# EAGLE design motadora (EAGLE 6.5.0)
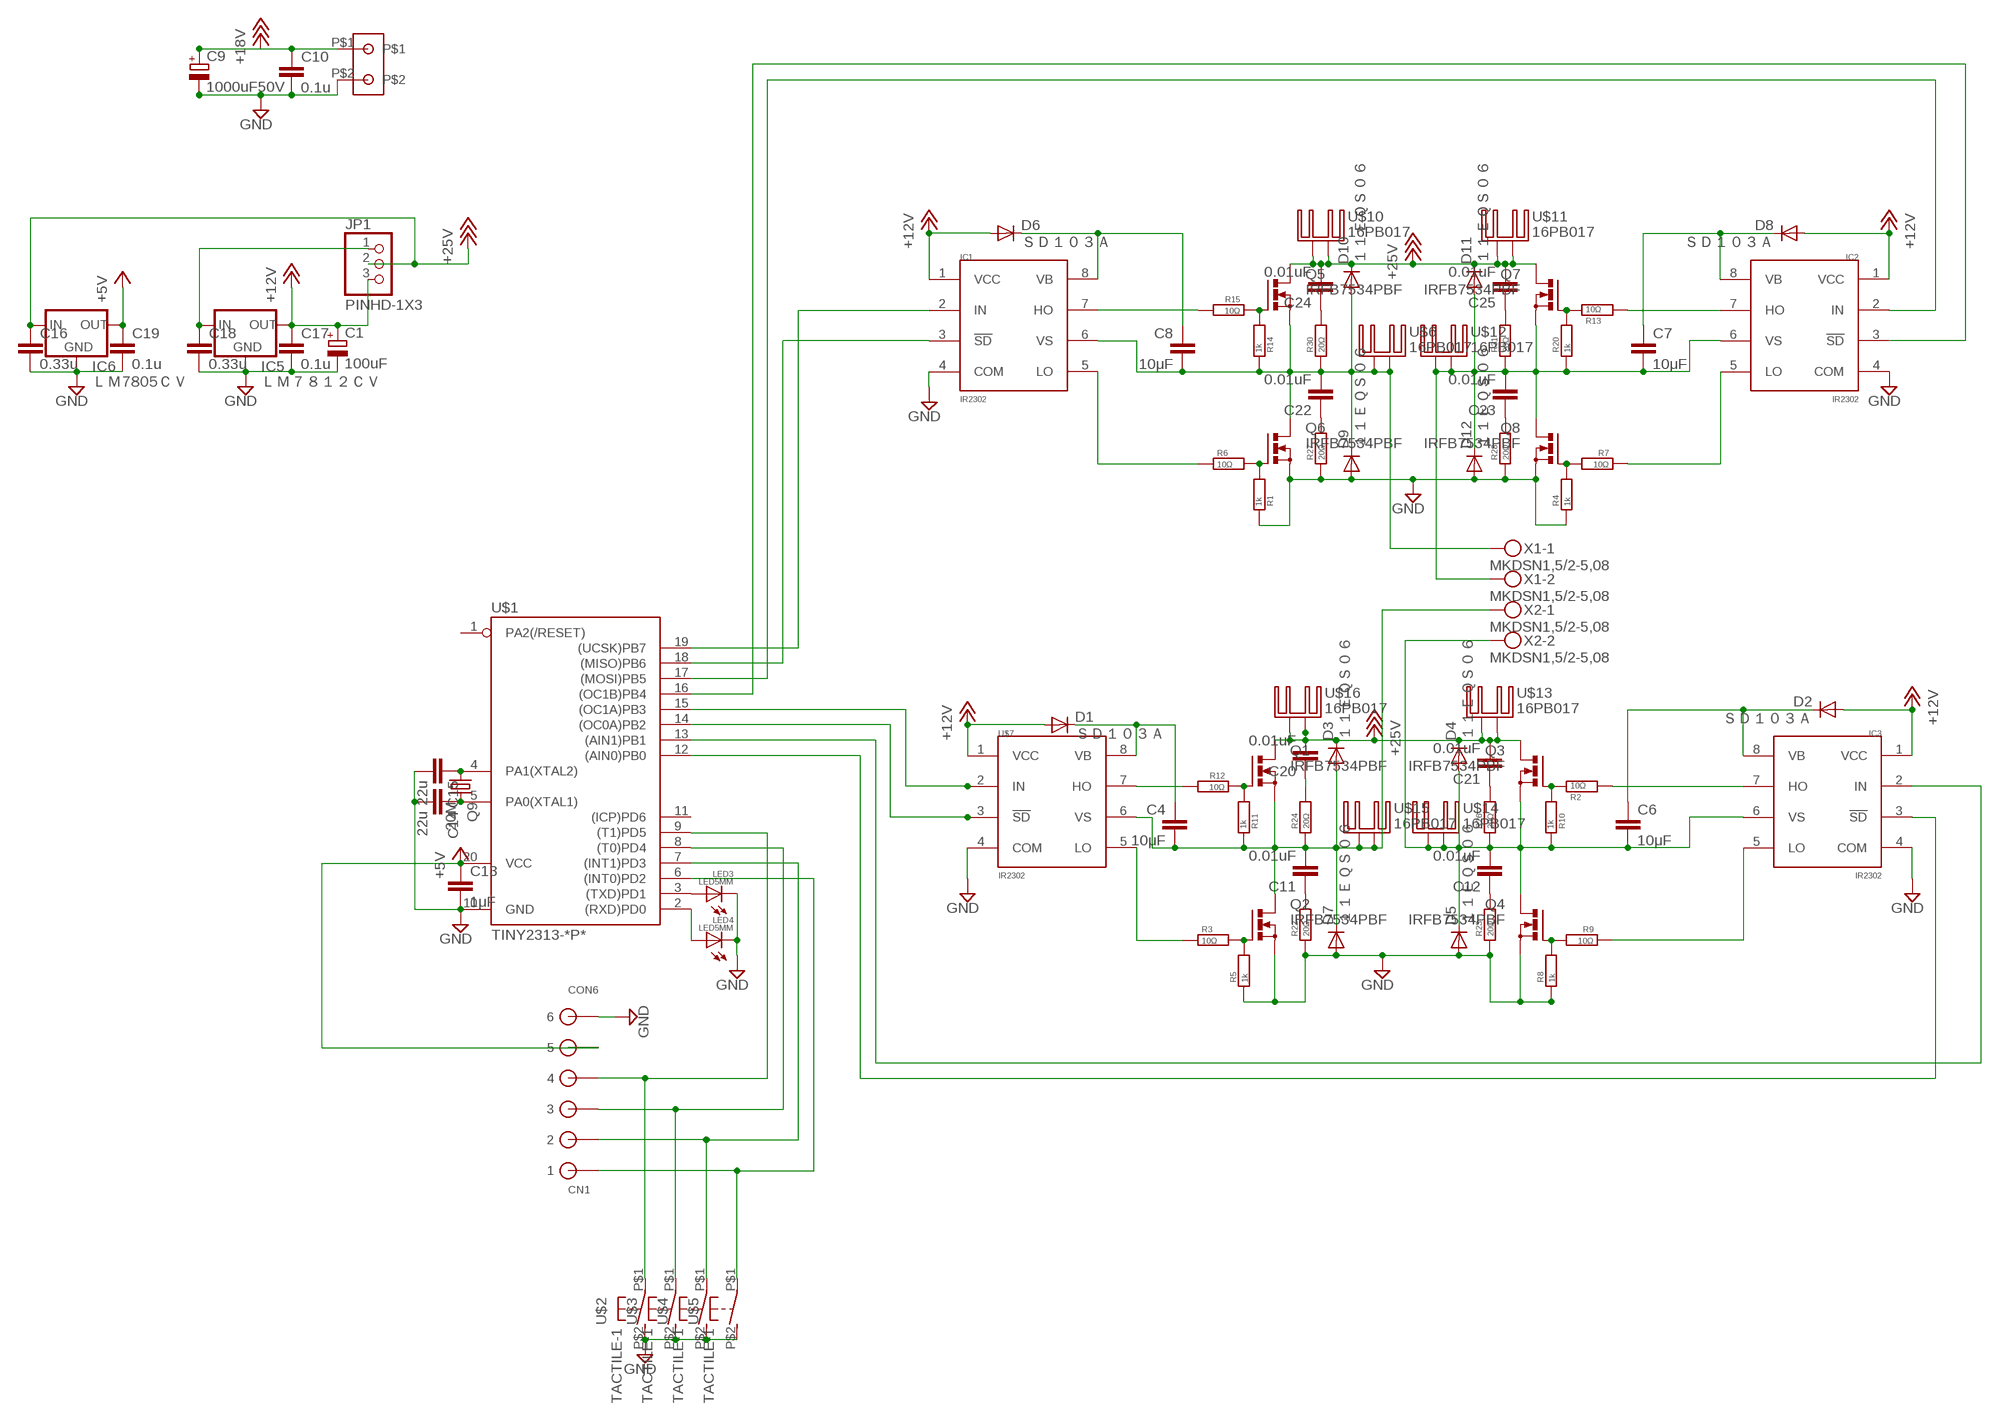
[diagram p0: schematic, sheet 1]

## Parts
C1  100uF  CPOL-EUTT2D6  [TT2D6]
C4  10μF  C-EU025-025X050  [C025-025X050]
C6  10μF  C-EU025-025X050  [C025-025X050]
C7  10μF  C-EU025-025X050  [C025-025X050]
C8  10μF  C-EU025-025X050  [C025-025X050]
C9  1000uF50V  CPOL-EUE5-13  [E5-13]
C10  0.1u  C5/3  [C5B3]
C11  0.01uF  C-EU025-024X044  [C025-024X044]
C12  0.01uF  C-EU025-024X044  [C025-024X044]
C13  1μF  C-EU050-025X075  [C050-025X075]
C14  22u  C-EU025-024X044  [C025-024X044]
C15  22u  C-EU025-024X044  [C025-024X044]
C16  0.33u  C-EU025-025X050  [C025-025X050]
C17  0.1u  C-EU025-025X050  [C025-025X050]
C18  0.33u  C-EU025-025X050  [C025-025X050]
C19  0.1u  C-EU025-025X050  [C025-025X050]
C20  0.01uF  C-EU025-024X044  [C025-024X044]
C21  0.01uF  C-EU025-024X044  [C025-024X044]
C22  0.01uF  C-EU025-024X044  [C025-024X044]
C23  0.01uF  C-EU025-024X044  [C025-024X044]
C24  0.01uF  C-EU025-024X044  [C025-024X044]
C25  0.01uF  C-EU025-024X044  [C025-024X044]
CN1  CON6  [CON6]
D1  ＳＤ１０３Ａ  DIODE-D-5  [D-5]
D2  ＳＤ１０３Ａ  DIODE-D-5  [D-5]
D3  １１ＥＱＳ０６  DIODE-D-5  [D-5]
D4  １１ＥＱＳ０６  DIODE-D-5  [D-5]
D5  １１ＥＱＳ０６  DIODE-D-5  [D-5]
D6  ＳＤ１０３Ａ  DIODE-D-5  [D-5]
D7  １１ＥＱＳ０６  DIODE-D-5  [D-5]
D8  ＳＤ１０３Ａ  DIODE-D-5  [D-5]
D9  １１ＥＱＳ０６  DIODE-D-5  [D-5]
D10  １１ＥＱＳ０６  DIODE-D-5  [D-5]
D11  １１ＥＱＳ０６  DIODE-D-5  [D-5]
D12  １１ＥＱＳ０６  DIODE-D-5  [D-5]
IC1  IR2302  IR2302IR2302  [DIL08]
IC2  IR2302  IR2302IR2302  [DIL08]
IC3  IR2302  IR2302IR2302  [DIL08]
IC5  ＬＭ７８１２ＣＶ  78XXS  [78XXS]
IC6  ＬＭ7805ＣＶ  78XXS  [78XXS]
JP1  PINHD-1X3  [1X03]
LED3  LED5MM  [LED5MM]
LED4  LED5MM  [LED5MM]
Q1  IRFB7534PBF  BUZ11BV  [TO220BV]
Q2  IRFB7534PBF  BUZ11BV  [TO220BV]
Q3  IRFB7534PBF  BUZ11BV  [TO220BV]
Q4  IRFB7534PBF  BUZ11BV  [TO220BV]
Q5  IRFB7534PBF  BUZ11BV  [TO220BV]
Q6  IRFB7534PBF  BUZ11BV  [TO220BV]
Q7  IRFB7534PBF  BUZ11BV  [TO220BV]
Q8  IRFB7534PBF  BUZ11BV  [TO220BV]
Q9  20M  CRYSTALHC49S  [HC49/S]
R1  1k  R-EU_0207/7  [0207/7]
R2  10Ω  R-EU_1/4W(2.5MM)  [1/4W(2.5MM)_]
R3  10Ω  R-EU_0207/10  [0207/10]
R4  1k  R-EU_0207/7  [0207/7]
R5  1k  R-EU_0207/7  [0207/7]
R6  10Ω  R-EU_0207/10  [0207/10]
R7  10Ω  R-EU_0207/10  [0207/10]
R8  1k  R-EU_0207/7  [0207/7]
R9  10Ω  R-EU_0207/10  [0207/10]
R10  1k  R-EU_1/4W(2.5MM)  [1/4W(2.5MM)_]
R11  1k  R-EU_1/4W(2.5MM)  [1/4W(2.5MM)_]
R12  10Ω  R-EU_1/4W(2.5MM)  [1/4W(2.5MM)_]
R13  10Ω  R-EU_1/4W(2.5MM)  [1/4W(2.5MM)_]
R14  1k  R-EU_1/4W(2.5MM)  [1/4W(2.5MM)_]
R15  10Ω  R-EU_1/4W(2.5MM)  [1/4W(2.5MM)_]
R20  1k  R-EU_1/4W(2.5MM)  [1/4W(2.5MM)_]
R22  20Ω  R-EU_0207/2V  [0207/2V]
R23  20Ω  R-EU_0207/2V  [0207/2V]
R24  20Ω  R-EU_0207/2V  [0207/2V]
R26  20Ω  R-EU_0207/2V  [0207/2V]
R27  20Ω  R-EU_0207/2V  [0207/2V]
R28  20Ω  R-EU_0207/2V  [0207/2V]
R30  20Ω  R-EU_1/4W(2.5MM)  [1/4W(2.5MM)_]
R31  20Ω  R-EU_0207/2V  [0207/2V]
T2  TANSIDAI  [A]
U$1  TINY2313-*P*  [DIL20]
U$2  TACTILE-1  [TACTILE]
U$3  TACTILE-1  [TACTILE]
U$4  TACTILE-1  [TACTILE]
U$5  TACTILE-1  [TACTILE]
U$6  16PB017  [16PB017]
U$7  IR2302  IR2302IR2302  [DIL08]
U$10  16PB017  [16PB017]
U$11  16PB017  [16PB017]
U$12  16PB017  [16PB017]
U$13  16PB017  [16PB017]
U$14  16PB017  [16PB017]
U$15  16PB017  [16PB017]
U$16  16PB017  [16PB017]
X1  MKDSN1,5/2-5,08  [MKDSN1,5/2-5,08]
X2  MKDSN1,5/2-5,08  [MKDSN1,5/2-5,08]

## Nets
+5V: C13.1 C19.1 CN1.P$5 IC6.OUT U$1.20(VCC)
+12V: C1.+ C17.1 D1.A D2.A D6.A D8.A IC1.1(VCC) IC2.1(VCC) IC3.1(VCC) IC5.OUT JP1.3 U$7.1(VCC)
+18V: C9.+ C10.1 C16.1 C20.2 C21.2 C24.2 C25.2 D3.C D4.C D10.C D11.C IC6.IN JP1.2 Q1.D Q3.D Q5.D Q7.D T2.P$1 U$10.P$1(K) U$10.P$2(K) U$11.P$1(K) U$11.P$2(K) U$13.P$1(K) U$13.P$2(K) U$16.P$1(K) U$16.P$2(K) ; supply symbol labelled +25V
GND: C1.- C9.- C10.2 C13.2 C14.2 C15.2 C16.2 C17.2 C18.2 C19.2 CN1.P$6 D5.A D7.A D9.A D12.A IC1.4(COM) IC2.4(COM) IC3.4(COM) IC5.GND IC6.GND LED3.K(C) LED4.K(C) Q2.S Q4.S Q6.S Q8.S R1.1 R4.1 R5.1 R8.1 R22.1 R23.1 R27.1 R28.1 T2.P$2 U$1.10(GND) U$2.P$2(S) U$3.P$2(S) U$4.P$2(S) U$5.P$2(S) U$7.4(COM)
N$1: IC1.7(HO) R15.4
N$2: IC2.7(HO) R13.4
N$3: IC3.7(HO) R2.4
N$4: Q2.G R3.2 R5.2
N$5: R12.4 U$7.7(HO)
N$6: IC1.5(LO) R6.1
N$7: Q1.G R11.4 R12.3
N$8: C4.2 C11.2 D3.A D7.C Q1.S Q2.D R11.3 R24.1 U$7.6(VS) U$15.P$1(K) U$15.P$2(K) X2.1
N$9: C4.1 D1.C U$7.8(VB)
N$10: C6.1 D2.C IC3.8(VB)
N$11: R3.1 U$7.5(LO)
N$12: C7.1 D8.C IC2.8(VB)
N$13: Q5.G R14.4 R15.3
N$15: C6.2 C12.2 D4.A D5.C IC3.6(VS) Q3.S Q4.D R10.3 R26.1 U$14.P$1(K) U$14.P$2(K) X2.2
N$16: C8.1 D6.C IC1.8(VB)
N$17: Q4.G R8.2 R9.2
N$18: CN1.P$2 U$1.7((INT1)PD3) U$4.P$1(P)
N$19: C7.2 C23.2 D11.A D12.C IC2.6(VS) Q7.S Q8.D R20.3 R31.1 U$12.P$1(K) U$12.P$2(K) X1.2
N$20: CN1.P$1 U$1.6((INT0)PD2) U$5.P$1(P)
N$21: Q6.G R1.2 R6.2
N$22: C14.1 Q9.2 U$1.5(PA0(XTAL1))
N$23: LED3.A U$1.3((TXD)PD1)
N$24: IC1.3(!SD) U$1.18((MISO)PB6)
N$25: C15.1 Q9.1 U$1.4(PA1(XTAL2))
N$26: Q8.G R4.2 R7.2
N$27: C8.2 C22.2 D9.C D10.A IC1.6(VS) Q5.S Q6.D R14.3 R30.3 U$6.P$1(K) U$6.P$2(K) X1.1
N$32: LED4.A U$1.2((RXD)PD0)
N$37: C18.1 IC5.IN JP1.1
N$38: C11.1 R22.2
N$39: C12.1 R23.2
N$40: IC2.5(LO) R7.1
N$42: C20.1 R24.2
N$43: C21.1 R26.2
N$44: C22.1 R27.2
N$45: C23.1 R28.2
N$46: C24.1 R30.4
N$47: C25.1 R31.2
N$48: Q3.G R2.3 R10.4
N$51: Q7.G R13.3 R20.4
N$54: IC3.5(LO) R9.1
N$55: IC1.2(IN) U$1.19((UCSK)PB7)
N$57: IC2.2(IN) U$1.17((MOSI)PB5)
N$58: IC2.3(!SD) U$1.16((OC1B)PB4)
N$59: U$1.15((OC1A)PB3) U$7.2(IN)
N$60: U$1.14((OC0A)PB2) U$7.3(!SD)
N$61: IC3.2(IN) U$1.13((AIN1)PB1)
N$62: IC3.3(!SD) U$1.12((AIN0)PB0)
N$63: CN1.P$4 U$1.9((T1)PD5) U$2.P$1(P)
N$64: CN1.P$3 U$1.8((T0)PD4) U$3.P$1(P)
Unconnected: U$1.1(PA2(/RESET)) U$1.11((ICP)PD6)

## Library data of the parts
C1 C9 = _rcl:CPOL-EU: POLARIZED CAPACITOR, European symbol
C4 C6-C8 C14 C15 = _rcl:C-EU: CAPACITOR, European symbol
C10 = capacitor-wima:C: CAPACITOR naming: grid - package width
C11-C13 C16-C25 = _resistor(抵抗):C-EU: CAPACITOR, European symbol
CN1 = _XH-con(XHｺﾈｸﾀ):CON6: low insertion connector 6
D1-D12 = _diode(ﾀﾞｲｵｰﾄﾞ):DIODE-: DIODE
IC1-IC3 U$7 = _irs(ｹﾞｰﾄﾄﾞﾗｲﾊﾞIC):IR2302
IC5 IC6 = 00v-reg(ﾄﾗﾝｼﾞｽﾀ&FET):78XXS: VOLTAGE REGULATOR
JP1 = _pinhead(ﾋﾟﾝﾍｯﾀﾞ):PINHD-1X3: PIN HEADER
LED3 LED4 = _led:LED
Q1-Q8 = transistor-power:BUZ11: N-CHANNEL MOS FET
Q9 = crystal:CRYSTAL: CRYSTAL; OC_FARNELL: 1667008; OC_NEWARK: unknown
R1-R15 R20 R22-R24 R26-R28 R30 R31 = _resistor(抵抗):R-EU_: RESISTOR, European symbol
T2 = 000tansidai:TANSIDAI: TANSIDAI 1Kyoku
U$1 = avr-6:TINY2313*: Atmel Tiny2313 2K Flash, 128 bytes EEPROM, 128 bytes RAM
U$2-U$5 = _switch:TACTILE-1
U$6 U$10-U$16 = _Heatsink(ﾋｰﾄｼﾝｸ秋月):16PB017
X1 X2 = 0con-phoenix-508(ﾀｰﾐﾅﾙ):MKDSN1,5/2-5,08: MKDSN 1,5/ 2-5,08 Printklemme Nennstrom: 13,5 A Nennspannung: 250 V Rastermaß: 5,08 mm Polzahl: 2 Anschlussart: Schraubanschluss Montage: Löten Anschlussrichtung Leiter/Platine: 0 ° Artikelnummer: 1729128 Source: http://eshop.phoenixcontact.com .. 1729128.pdf; MPN: MKDSN 1,5/2-5.08; OC_FARNELL: 1792903; OC_NEWARK: 30M2397

## Board
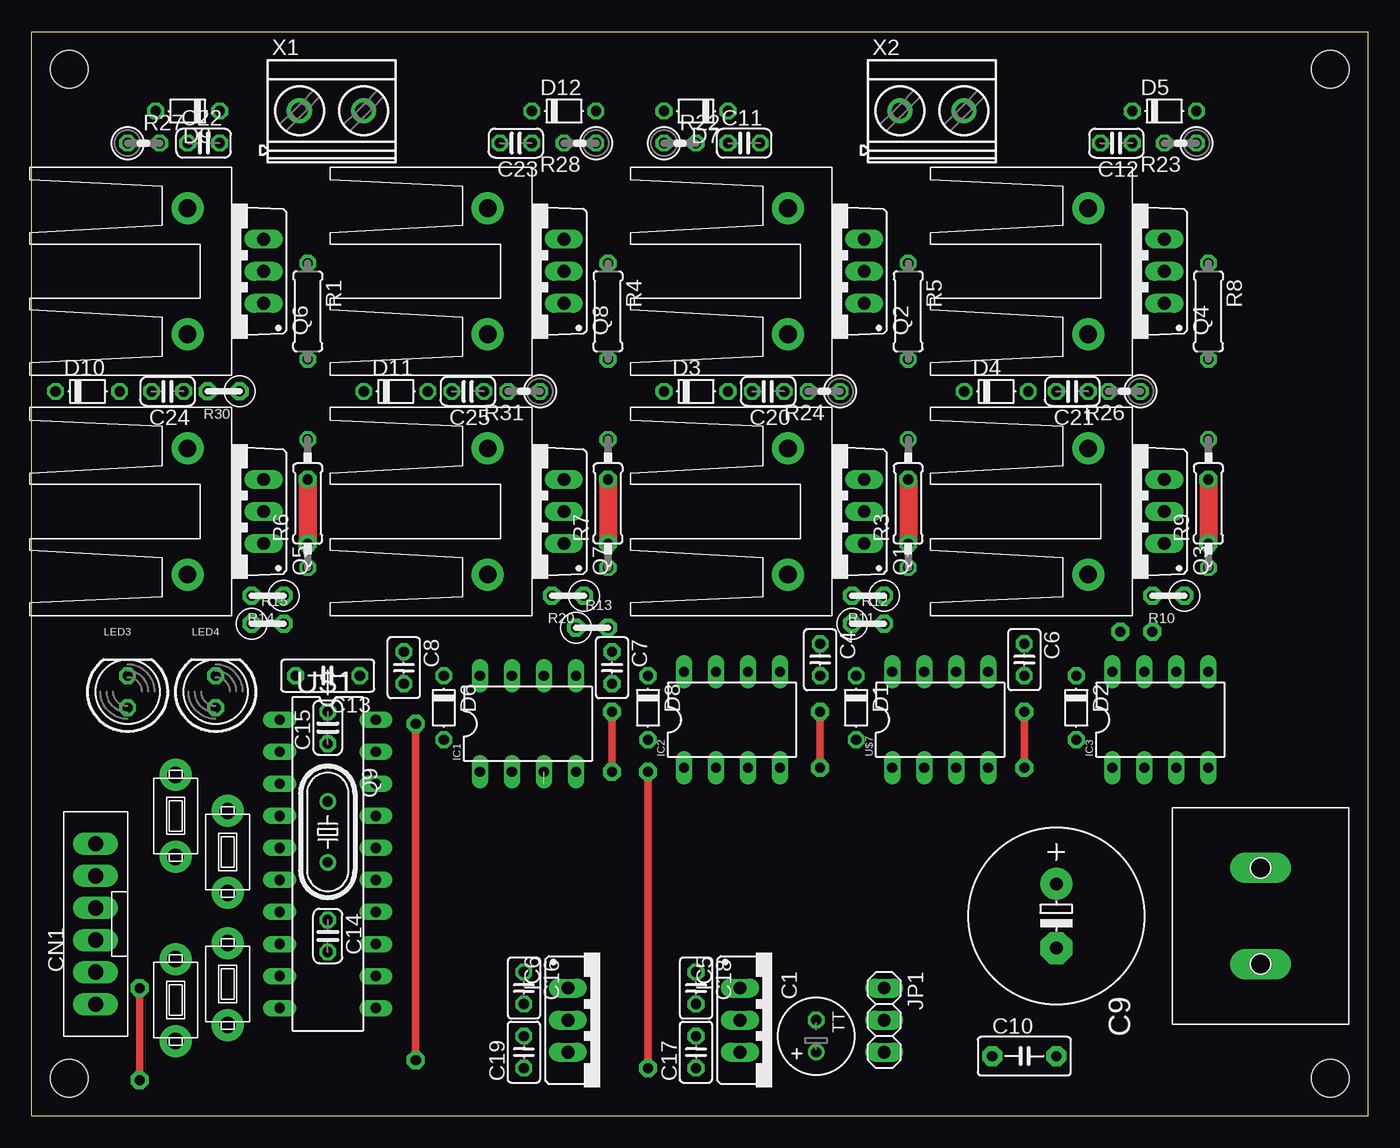
[diagram p1: board, top side]
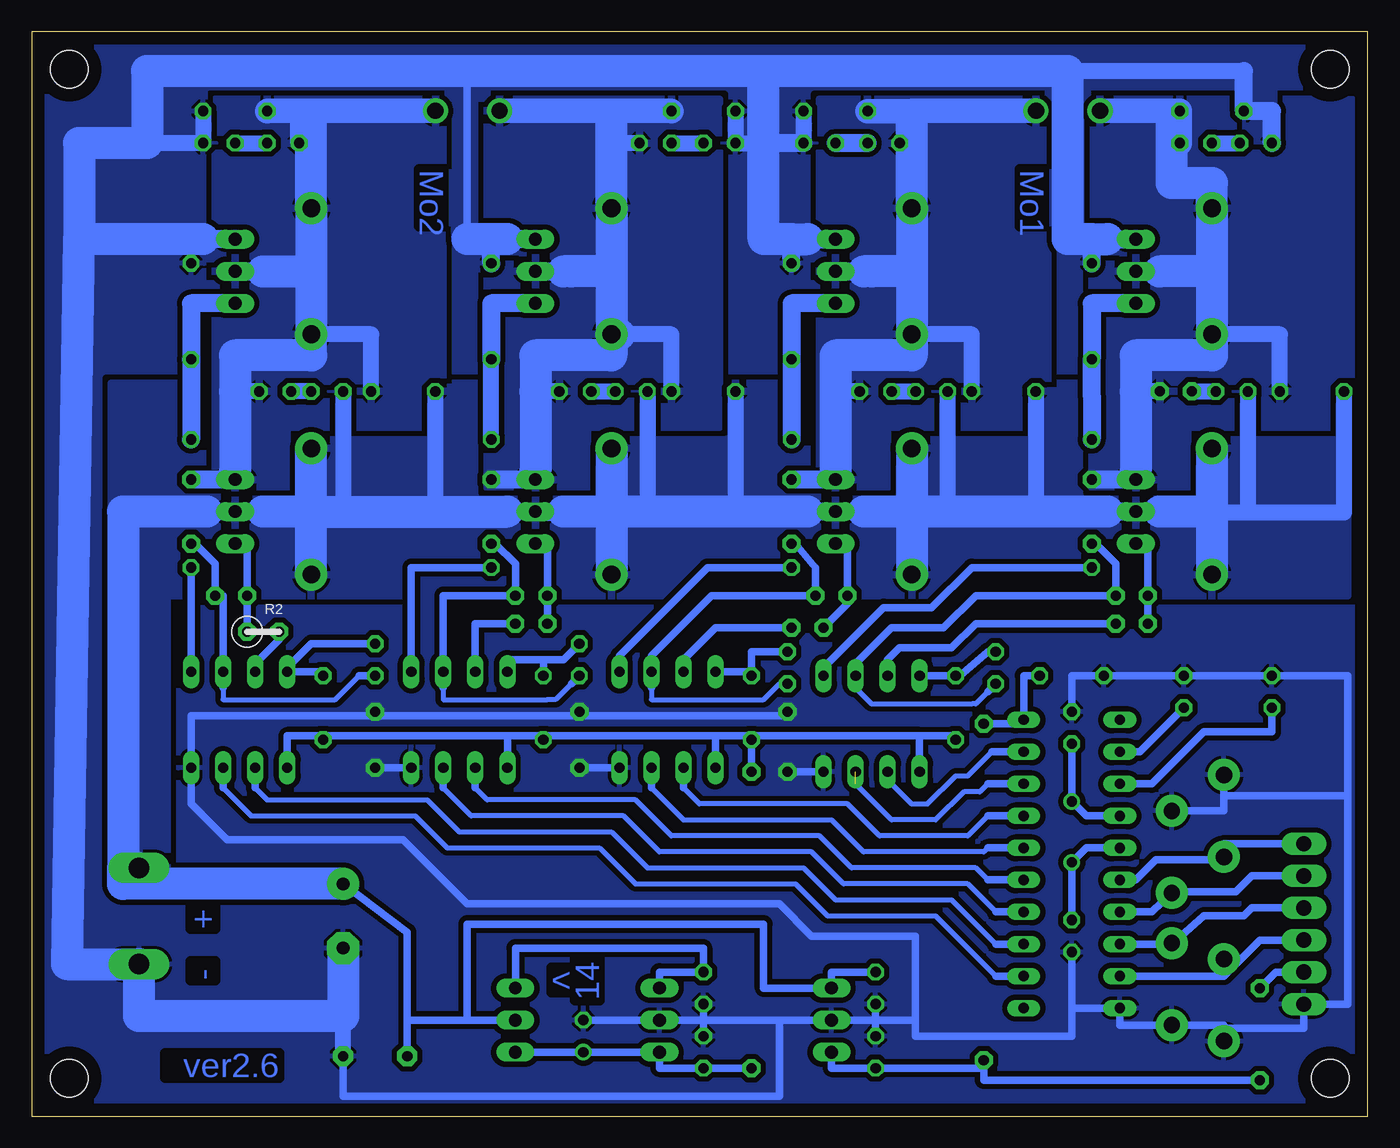
[diagram p2: board, bottom side, seen from below]

Size 106 x 86 mm. Coordinates in mm from the lower left corner, seen from the top.
Outline: 0,0 0,86 106,86 106,0 0,0
Copper layers (1*16): Top 0.035mm / dielectric 1.5mm / Bottom 0.035mm
Design rules "default *": minimum track width 10mil, minimum drill 24mil, track to track 8mil, track to pad 8mil, pad to pad 8mil, via to via 8mil, smd to smd 8mil, copper to edge 40mil, drill to drill 8mil, minimum pad ring 10mil, minimum via ring 8mil, stop-mask expansion 4mil, vias tented up to drill 0mil, thermal gap 10mil
Holes 3 mm at 3,3 103,3 103,83 3,83

### Footprints (pad centres in the part's own frame; a part is rotated, then mirrored left to right if it is on the bottom)
TT2D6 = drill 0.813: + -1.27,0 | drill 0.813 octagon: - 1.27,0
C025-025X050 = drill 0.813 octagon: 1 -1.27,0; 2 1.27,0
E5-13 = drill 1.016 pad 2.54: + -2.54,0 | drill 1.016 pad 2.54 octagon: - 2.54,0
C5B3 = drill 0.813 pad 1.6 octagon: 1 -2.54,0; 2 2.54,0
C025-024X044 = drill 0.813 octagon: 1 -1.27,0; 2 1.27,0
C050-025X075 = drill 0.813 octagon: 1 -2.54,0; 2 2.54,0
CON6 = drill 1.2 long: P$1 6.35,0; P$2 3.81,0; P$3 1.27,0; P$4 -1.27,0; P$5 -3.81,0; P$6 -6.35,0
D-5 = drill 0.813 octagon: A 2.54,0; C -2.54,0
DIL08 = drill 0.813 long: 1 -3.81,-3.81; 2 -1.27,-3.81; 3 1.27,-3.81; 4 3.81,-3.81; 5 3.81,3.81; 6 1.27,3.81; 7 -1.27,3.81; 8 -3.81,3.81
78XXS = drill 1.016 long: GND 0,-2.54; IN -2.54,-2.54; OUT 2.54,-2.54
1X03 = drill 1.016 long: 1 -2.54,0; 2 0,0; 3 2.54,0
LED5MM = drill 0.813 octagon: A -1.27,0; K 1.27,0
TO220BV = drill 1.016 long: D 0,-2.54; G -2.54,-2.54; S 2.54,-2.54
HC49/S = drill 0.813: 1 -2.413,0; 2 2.413,0
0207/7 = drill 0.813 octagon: 1 -3.81,0; 2 3.81,0
1/4W(2.5MM)_ = drill 0.8 pad 1.422 octagon: 3 1.27,0; 4 -1.27,0
0207/10 = drill 0.813 octagon: 1 -5.08,0; 2 5.08,0
0207/2V = drill 0.813 octagon: 1 -1.27,0; 2 1.27,0
A = drill 1.6 long: P$1 3.81,0; P$2 -3.81,0
DIL20 = drill 0.813 long: 1 -11.43,-3.81; 2 -8.89,-3.81; 3 -6.35,-3.81; 4 -3.81,-3.81; 5 -1.27,-3.81; 6 1.27,-3.81; 7 3.81,-3.81; 8 6.35,-3.81; 9 8.89,-3.81; 10 11.43,-3.81; 11 11.43,3.81; 12 8.89,3.81; 13 6.35,3.81; 14 3.81,3.81; 15 1.27,3.81; 16 -1.27,3.81; 17 -3.81,3.81; 18 -6.35,3.81; 19 -8.89,3.81; 20 -11.43,3.81
TACTILE = drill 1.3 pad 2.54: P$1 3.25,0; P$2 -3.25,0
16PB017 = drill 1.4 pad 2.54: P$1 -5,3.5; P$2 5,3.5
MKDSN1,5/2-5,08 = drill 1.3 pad 2: 1 -2.561,0.025; 2 2.519,0.025

### Placement (x,y rotation side)
C1  62.23,6.35 90 top
C4  62.55,36.2 270 top
C6  78.74,36.2 270 top
C7  46.04,35.56 270 top
C8  29.53,35.56 270 top
C9  81.28,15.88 270 top
C10  78.74,4.76 0 top
C11  56.52,77.15 0 top
C12  86.04,77.15 180 top
C13  23.5,34.92 180 top
C14  23.5,14.29 270 top
C15  23.5,30.8 90 top
C16  39.05,10.16 270 top
C17  52.7,5.08 90 top
C18  52.7,10.16 270 top
C19  39.05,5.08 90 top
C20  58.42,57.47 180 top
C21  82.55,57.47 180 top
C22  13.65,77.15 0 top
C23  38.42,77.15 180 top
C24  10.79,57.47 180 top
C25  34.61,57.47 180 top
CN1  5.08,15.24 90 top
D1  65.41,32.38 270 top
D2  82.87,32.38 270 top
D3  52.7,57.47 0 top
D4  76.52,57.47 0 top
D5  89.85,79.69 0 top
D6  32.7,32.38 270 top
D7  52.7,79.69 180 top
D8  48.9,32.38 270 top
D9  12.38,79.69 180 top
D10  4.45,57.47 0 top
D11  28.89,57.47 0 top
D12  42.23,79.69 0 top
IC1  39.37,31.11 0 top
IC2  55.56,31.43 0 top
IC3  89.53,31.43 0 top
IC5  58.74,7.62 270 top
IC6  45.09,7.62 270 top
JP1  67.63,7.62 270 top
LED3  7.62,33.66 90 top
LED4  14.61,33.66 90 top
Q1  63.5,47.94 90 top
Q2  63.5,66.99 90 top
Q3  87.31,47.94 90 top
Q4  87.31,66.99 90 top
Q5  15.88,47.94 90 top
Q6  15.88,66.99 90 top
Q7  39.69,47.94 90 top
Q8  39.69,66.99 90 top
Q9  23.5,22.54 270 top
R1  21.91,63.82 270 top
R2  87.63,38.42 180 bottom
R3  69.53,48.58 90 top
R4  45.72,63.82 270 top
R5  69.53,63.82 270 top
R6  21.91,48.58 90 top
R7  45.72,48.58 90 top
R8  93.34,63.82 270 top
R9  93.34,48.58 90 top
R10  90.17,41.27 0 top
R11  66.36,41.27 0 top
R12  66.36,39.05 180 top
R13  44.45,38.73 180 top
R14  18.73,41.27 0 top
R15  18.73,39.05 180 top
R20  42.55,41.27 0 top
R22  51.44,77.15 0 top
R23  91.12,77.15 180 top
R24  62.87,57.47 180 top
R26  86.68,57.47 180 top
R27  8.89,77.15 0 top
R28  43.5,77.15 180 top
R30  15.24,57.47 0 top
R31  39.05,57.47 180 top
T2  97.47,15.88 90 top
U$1  23.5,20 270 top
U$2  11.43,9.21 90 top
U$3  15.56,10.48 90 top
U$4  15.56,20.95 270 top
U$5  11.43,23.81 270 top
U$6  15.88,66.99 90 top
U$7  72.07,31.43 0 top
U$10  15.88,47.94 90 top
U$11  39.69,47.94 90 top
U$12  39.69,66.99 90 top
U$13  63.5,47.94 90 top
U$14  87.31,66.99 90 top
U$15  63.5,66.99 90 top
U$16  87.31,47.94 90 top
X1  23.81,79.69 0 top
X2  71.44,79.69 0 top

### Tracks (layer width: path | path; a pad name or v marks a point on that pad's centre or on a via)
+5V  (via drill 0.8 pad 1.42)
  Top 0.61: v30.48,31.11 v30.48,4.45 | v8.57,10.16 v8.57,2.86
  Bottom 0.61: IC6.OUT 42.55,3.81 C19.1 30.48,3.81 | C13.1 27.3,34.92 U$1.20 27.62,31.11 v30.48,31.11 | CN1.P$5 7.3,11.43 v8.57,10.16 | v8.57,2.86 30.48,2.86 30.48,3.81 | v30.48,4.45 30.48,3.81
+12V  (via drill 0.8 pad 1.42)
  Top 0.61: v48.9,3.81 v48.9,27.3
  Bottom 0.61: D1.A 65.41,30.16 | 65.41,30.16 68.26,30.16 | D2.A 82.87,30.16 | 82.87,30.16 85.72,30.16 IC3.1 | 48.9,30.16 51.75,30.16 | IC1.1 35.56,30.16 | 35.56,30.16 48.9,30.16 | 48.9,30.16 D8.A v48.9,27.3 | 51.75,30.16 65.41,30.16 | 68.26,30.16 82.87,30.16 | U$7.1 68.26,30.16 | IC2.1 51.75,30.16 | 35.56,30.16 32.7,30.16 D6.A | v48.9,3.81 C17.1 56.2,3.81 IC5.OUT C1.+ JP1.3
+18V
  Bottom 0.61: 63.82,47.94 60,47.94 | Q7.D 40.32,47.94 40.01,47.94 36.19,47.94 | C16.1 42.55,11.43 IC6.IN 47.94,10.16 47.94,15.24 71.44,15.24 71.44,7.62 | JP1.2 71.44,7.62 | 71.44,7.62 76.2,7.62 | 76.2,7.62 C10.1 | C9.+ 76.2,14.61 76.2,7.62
  Bottom 1.27: 40.32,47.94 50.16,47.94 D3.C | Q1.D 68.26,47.94 | 87.63,47.94 Q3.D 92.08,47.94 | D10.C 1.91,47.86 9.53,47.86 | 9.53,47.86 12.38,47.86 12.38,47.94 U$10.P$2 | D11.C 26.35,47.94 | D4.C 73.98,47.94 | C24.2 9.53,47.86 | C21.2 81.28,47.94 | C20.2 57.15,47.94 | C25.2 33.34,47.94
  Bottom 1.422: 15.88,47.94 16.51,47.94 Q5.D 20.64,47.94 | Q1.D 63.82,47.94 | Q7.D 43.18,47.94
  Bottom 2.54: U$16.P$1 83.81,47.94 | 83.81,47.94 U$16.P$2 | U$13.P$1 60,47.94 U$13.P$2 | U$11.P$1 36.19,47.94 U$11.P$2 | U$10.P$1 U$10.P$2 12.38,47.94 16.51,47.94 | 20.64,47.94 26.35,47.94 33.34,47.94 40.01,47.94 | 44.45,47.94 50.16,47.94 57.15,47.94 63.82,47.94 | 83.81,47.94 87.63,47.94 | 83.81,47.94 81.28,47.94 73.98,47.94 68.26,47.94 | 92.08,47.94 98.74,47.94 98.74,19.68 | C9.+ 98.74,18.41 98.74,19.68 | 98.74,19.68 T2.P$1
  pour Bottom (isolate 0.406, rank 2): 1.59,58.1 99.69,58.1 99.69,18.41 95.25,18.41 95.25,41.27 1.59,41.27
GND  (via drill 0.8 pad 1.42)
  Top 0.61: v46.04,27.3 v46.04,32.07 | v62.55,27.62 v62.55,32.07 | v78.74,27.62 v78.74,32.07
  Bottom 0.61: 52.7,7.62 C17.2 | 39.05,7.62 IC6.GND | C19.2 39.05,7.62 | 24.45,70.17 21.91,70.17 R1.1 | 48.26,69.53 47.94,69.53 | 71.44,82.87 71.44,69.53 | C15.2 23.5,34.92 C13.2 LED4.K | LED3.K LED4.K | U$5.P$2 11.43,25.4 | U$2.P$2 11.43,6.99 | 23.5,8.57 U$1.10 19.68,7.23 U$3.P$2 11.43,7.23 11.43,6.99 | 23.5,8.57 C14.2 | LED4.K 1.59,34.92 1.59,25.4 | 1.59,25.4 1.59,8.89 CN1.P$6 5.08,6.99 11.43,6.99 | U$4.P$2 11.43,24.2 11.43,25.4 | 11.43,25.4 1.59,25.4 | IC1.4 v46.04,27.3 | v46.04,32.07 46.04,31.75 62.55,31.75 | IC2.4 v62.55,27.62 | v62.55,32.07 62.55,31.75 | 62.55,31.75 78.74,31.75 | U$7.4 v78.74,27.62 | R8.1 93.34,69.22 93.03,69.53 | v78.74,32.07 78.74,31.75 | 78.74,31.75 93.34,31.75 IC3.4 93.34,24.77 90.49,21.91 76.52,21.91 71.44,16.83 46.67,16.83 44.13,14.29 35.88,14.29 35.88,7.62 | C16.2 39.05,7.62 | IC6.GND 46.67,7.62 | 46.67,7.62 52.7,7.62 | 52.7,7.62 IC5.GND C1.- | 23.5,8.57 23.5,6.35 35.88,6.35 35.88,7.62 | C18.2 52.7,7.62 | C10.2 81.28,1.59 46.67,1.59 46.67,7.62 | C9.- 81.28,8.26 97.47,8.26 | IC6.GND 35.88,7.62
  Bottom 1.27: 47.62,69.53 47.94,69.53 | 47.94,77.15 R22.1 D7.A | 9.84,82.87 23.81,82.87 | 96.84,77.15 R23.1 D5.A | D12.A R28.1 | C10.2 C9.-
  Bottom 1.422: Q2.S 68.26,69.53 69.53,69.53 R5.1 | Q4.S 92.39,69.53 | R4.1 45.72,69.53 | R1.1 21.91,69.53 | R27.1 7.62,79.69 D9.A 9.84,82.87 | R28.1 47.94,77.15 | 44.45,69.53 Q8.S | 20.64,69.53 Q6.S
  Bottom 2.54: 92.39,69.53 93.03,69.53 102.23,69.53 | 47.94,82.87 23.81,82.87 23.81,69.53 21.91,69.53 20.64,69.53 | 47.94,69.53 47.94,77.15 47.94,82.87 | 47.94,82.87 71.44,82.87 96.84,82.87 96.84,77.15 102.23,77.15 102.23,69.53 | 102.23,69.53 103.19,12.06 T2.P$2 97.47,8.26 97.47,7.94 81.28,7.94 C9.- | 47.62,69.53 45.72,69.53 44.45,69.53 | 68.26,69.53 71.44,69.53
  pour Bottom (isolate 0.406, rank 6): -5.4,89.22 -5.4,-4.45 109.22,-4.45 109.22,89.22
N$1
  Bottom 0.61: IC1.7 38.1,36.2 37.15,37.15 33.02,37.15 31.11,39.05 R15.4
N$2
  Bottom 0.61: IC2.7 54.29,36.2 51.75,38.73 R13.4
N$3
  Bottom 0.61: R2.4 86.36,37.78 88.27,35.88 IC3.7
N$4
  Bottom 1.27: R3.2 R5.2
  Bottom 1.422: Q2.G 69.53,64.45 R5.2
N$5
  Bottom 0.61: R12.4 70.8,39.05 U$7.7
N$6
  Bottom 0.61: IC1.5 43.18,35.56 38.42,40.32 34.61,40.32 31.43,43.5 R6.1
N$7
  Bottom 0.61: R11.4 R12.3 65.09,45.4 Q1.G
N$8  (via drill 0.8 pad 1.42)
  Top 1.422: v69.53,50.48 v69.53,45.4
  Bottom 0.406: 73.34,33.97 73.34,33.02 65.09,33.02 64.45,33.02 63.18,34.29
  Bottom 0.61: v69.53,45.4 69.22,45.4 67.63,43.81 R11.3 73.34,41.27 U$7.6 73.34,33.97 | C4.2 63.18,34.29
  Bottom 1.27: Q1.S 66.04,51.12 66.04,51.75 | D3.A 55.24,61.99 59.37,61.99 | R24.1 66.04,57.47 | C11.2 60,77.15
  Bottom 1.422: Q2.D 63.18,66.99 | Q1.S v69.53,50.48
  Bottom 1.93: X2.1 60,79.72 | 60,79.72 60,79.38 | D7.C 55.27,79.72 60,79.72
  Bottom 2.54: U$15.P$1 60,60.33 66.04,60.33 66.04,57.47 66.04,51.12 | U$15.P$2 U$15.P$1 | U$15.P$1 59.37,61.99 | U$15.P$2 60,66.99 63.18,66.99 63.82,66.99 | U$15.P$2 60,77.15 60,79.38 60.01,79.38
  pour Bottom (isolate 0.406): 69.85,80.64 69.85,49.85 61.91,49.85 61.91,54.61 51.44,54.61 51.44,80.64
N$9
  Bottom 0.61: C4.1 63.82,36.2 65.41,36.2 | 65.41,36.2 68.26,36.2 U$7.8 | D1.C 65.41,36.2
N$10
  Bottom 0.61: C6.1 83.82,37.47 85.72,35.56 IC3.8 82.87,35.24 D2.C
N$11
  Bottom 0.61: R3.1 75.88,43.5 U$7.5
N$12
  Bottom 0.61: IC2.8 48.9,35.24 D8.C 48.9,36.83 C7.1
N$13
  Bottom 0.61: Q5.G 17.46,45.4 R14.4 R15.3
N$15  (via drill 0.8 pad 1.42)
  Top 1.422: v93.34,50.48 v93.34,45.4
  Bottom 0.406: 90.81,33.97 90.81,33.02 81.92,33.02 80.01,34.92
  Bottom 0.61: U$14.P$1 | v93.34,45.4 93.03,45.4 91.44,43.81 R10.3 90.81,41.27 IC3.6 90.81,33.97 | 80.01,34.92 C6.2
  Bottom 1.27: Q3.S 89.85,51.12 | D4.A 79.06,61.99 U$14.P$1 | R26.1 89.85,57.47
  Bottom 1.422: Q4.D 86.04,66.99 | 83.82,77.15 C12.2 84.77,79.69 | Q3.S v93.34,50.48
  Bottom 1.93: X2.2 83.82,79.72 | 83.82,79.72 83.82,79.06 | 83.82,79.72 84.77,79.72 | 84.77,79.72 84.77,79.69 | D5.C 87.29,79.72 84.77,79.72
  Bottom 2.54: 87.63,66.99 86.04,66.99 83.82,66.99 | U$14.P$1 83.81,66.99 83.82,66.99 | 83.82,66.99 U$14.P$1 83.82,60.33 89.85,60.33 89.85,57.47 89.85,51.12 | U$14.P$2 | U$14.P$2 83.82,66.99 | U$14.P$2 83.82,79.06
  pour Bottom (isolate 0.406): 91.44,80.64 73.34,80.64 73.34,54.61 85.72,54.61 85.72,49.85 91.44,49.85
N$16
  Bottom 0.61: C8.1 30.16,36.83 32.38,34.92 D6.C IC1.8
N$17
  Bottom 1.422: Q4.G 93.34,64.45 R8.2 R9.2
N$18
  Bottom 0.61: U$1.7 17.14,16.19 U$4.P$1 15.56,17.78 10.48,17.78 9.21,19.05 CN1.P$2
N$19  (via drill 0.8 pad 1.42)
  Top 1.422: v45.72,50.48 v45.72,45.4
  Bottom 0.406: 56.83,33.97 56.83,33.02 47.94,33.02 46.67,34.29 C7.2
  Bottom 0.61: v45.72,45.4 45.4,45.4 43.81,43.5 R20.3 52.07,41.27 56.83,36.51 IC2.6 56.83,33.97
  Bottom 1.27: Q7.S 42.23,51.12 | D11.A 31.43,61.99 U$12.P$1 | R31.1 42.23,57.47 | C23.2 36.83,76.83 36.19,76.83
  Bottom 1.422: Q8.D 39.37,66.99 | Q7.S v45.72,50.48
  Bottom 1.93: X1.2 36.19,79.72 36.19,79.38 36.51,79.69 D12.C
  Bottom 2.54: 42.23,51.12 42.23,57.47 42.23,60.33 36.19,60.33 U$12.P$1 U$12.P$2 | U$12.P$2 36.19,66.99 39.37,66.99 40.01,66.99 | U$12.P$2 36.19,76.83 36.19,79.38 36.2,79.38
  pour Bottom (isolate 0.406): 25.4,80.64 43.5,80.64 43.5,49.85 38.1,49.85 38.1,54.61 25.4,54.61
N$20
  Bottom 0.61: U$1.6 18.41,18.73 16.83,20.32 11.43,20.32 U$5.P$1 11.43,21.59 CN1.P$1
N$21
  Bottom 1.422: Q6.G 21.91,64.45 R1.2 21.91,57.15 R6.2
N$22
  Bottom 0.61: U$1.5 22.35,21.27 Q9.2 C14.1
N$23
  Bottom 0.61: LED3.A 7.62,30.48 13.02,30.48 17.14,26.35 U$1.3
N$24  (1 unrouted)
  Bottom 0.406: 30.16,26.35 30.8,25.72 32.07,25.72 34.29,23.5 37.78,23.5 40.64,26.35
  Bottom 0.61: U$1.18 30.16,26.35
N$25
  Bottom 0.61: U$1.4 22.35,23.81 Q9.1 C15.1
N$26
  Bottom 1.422: Q8.G 45.72,64.45 R4.2 R7.2
N$27  (via drill 0.8 pad 1.42)
  Top 1.422: v21.91,50.48 v21.91,45.4
  Bottom 0.406: 40.64,33.97 39.37,32.7 31.75,32.7 31.43,32.7 31.11,32.7 30.16,33.66
  Bottom 0.61: v21.91,45.4 21.59,45.4 20,43.81 R14.3 31.11,41.27 33.66,38.73 37.78,38.73 40.64,35.88 IC1.6 40.64,33.97 | C8.2 30.16,33.66
  Bottom 1.27: 18.41,51.12 Q5.S | D10.A 6.99,61.99 U$6.P$1 | R30.3 18.41,57.47
  Bottom 1.422: Q6.D 16.51,66.99 | Q5.S v21.91,50.48
  Bottom 1.93: X1.1 14.92,79.72 D9.C | D9.C C22.2 | D9.C 15.56,79.69 15.56,79.38
  Bottom 2.54: 18.41,51.12 18.41,57.47 18.41,60.33 12.38,60.33 U$6.P$1 U$6.P$2 | U$6.P$2 12.38,66.99 16.51,66.99 | U$6.P$2 12.38,73.98 15.56,73.98 15.56,79.38
  pour Bottom (isolate 0.406): 1.27,80.64 21.91,80.64 21.91,49.85 14.29,49.85 14.29,54.61 1.27,54.61
N$32
  Bottom 0.61: LED4.A 18.1,28.89 U$1.2
N$37
  Bottom 0.61: IC5.IN 56.2,11.43 C18.1 52.7,13.34 67.63,13.34 JP1.1
N$38
  Bottom 1.27: C11.1 R22.2
N$39
  Bottom 1.27: R23.2 C12.1
N$40
  Bottom 0.61: R7.1 52.39,43.5 59.37,36.51 IC2.5
N$42
  Bottom 1.27: R24.2 C20.1
N$43
  Bottom 1.27: C21.1 R26.2
N$44
  Bottom 1.27: C22.1 R27.2
N$45
  Bottom 1.422: C23.1 R28.2
N$46
  Bottom 1.27: R30.4 C24.1
N$47
  Bottom 1.27: R31.2 C25.1
N$48
  Bottom 0.61: R2.3 R10.4 88.9,45.4 Q3.G
N$51
  Bottom 0.61: Q7.G 41.27,45.4 R20.4 41.27,40.64 R13.3
N$54
  Bottom 0.61: R9.1 IC3.5
N$55
  Bottom 0.406: 38.1,26.67 36.2,24.77 34.92,24.77 32.7,26.99 31.75,26.99 29.84,28.89
  Bottom 0.61: U$1.19 29.84,28.89 | 38.1,26.67 IC1.2
N$57
  Bottom 0.406: 30.16,23.81 31.75,22.23 38.73,22.23 41.27,24.77 53.02,24.77 54.29,26.04
  Bottom 0.61: U$1.17 30.16,23.81 | 54.29,26.04 IC2.2
N$58
  Bottom 0.406: 30.16,21.27 30.48,20.95 40.01,20.95 42.55,23.5 54.29,23.5 56.83,26.04
  Bottom 0.61: U$1.16 30.16,21.27 | 56.83,26.04 IC2.3
N$59
  Bottom 0.406: 30.16,18.73 31.11,19.68 40.96,19.68 43.5,22.23 55.24,22.23 58.1,25.08 69.85,25.08 70.8,26.04
  Bottom 0.61: U$7.2 70.8,26.04 | U$1.15 30.16,18.73
N$60
  Bottom 0.406: 29.53,16.19 31.75,18.41 41.59,18.41 44.13,20.95 56.2,20.95 59.05,23.81 71.12,23.81 73.34,26.04
  Bottom 0.61: U$1.14 29.53,16.19 | 73.34,26.04 U$7.3
N$61
  Bottom 0.406: 88.27,26.04 87.31,25.08 74.61,25.08 72.07,22.54 60.01,22.54 57.15,19.68 44.77,19.68 42.23,17.14 33.02,17.14 29.53,13.65
  Bottom 0.61: IC3.2 88.27,26.04 | 29.53,13.65 U$1.13
N$62
  Bottom 0.406: 90.81,26.04 88.58,23.81 75.56,23.81 73.03,21.27 60.96,21.27 58.1,18.41 45.4,18.41 42.86,15.88 34.29,15.88 29.53,11.11
  Bottom 0.61: IC3.3 90.81,26.04 | 29.53,11.11 U$1.12
N$63
  Bottom 0.61: CN1.P$4 8.57,13.97 11.43,11.11 | 11.43,11.11 U$1.9 | U$2.P$1 11.43,11.11
N$64
  Bottom 0.61: U$1.8 15.56,13.65 | 15.56,13.65 13.02,15.88 9.84,15.88 9.21,16.51 CN1.P$3 | U$3.P$1 15.56,13.65

### Text on the board
Bottom: Mo1 | Mo2 | + | - | < | 14 | ver2.6